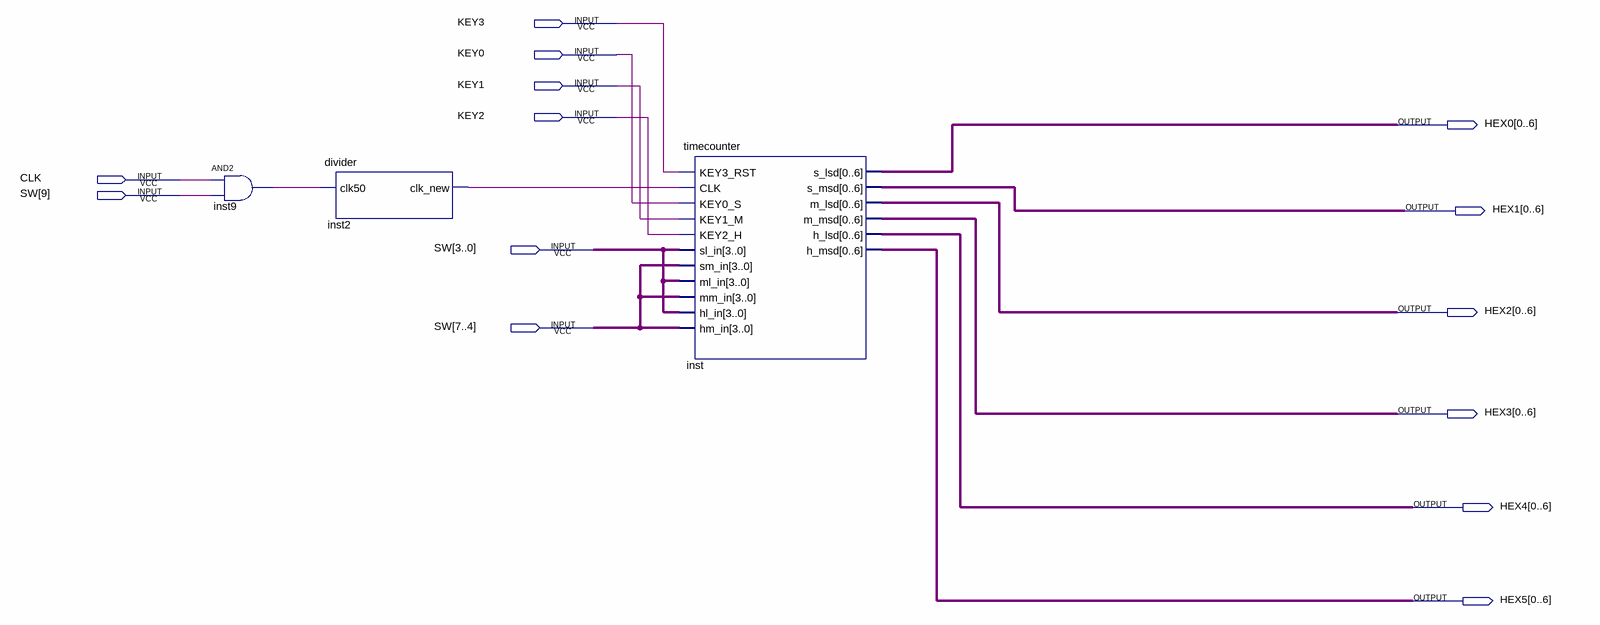
[diagram p0: schematic sheet]
// Quartus schematic TImingLab.bdf as structural Verilog: 3 symbols, 14 pins
module TImingLab (
  input  KEY3,
  input  KEY0,
  input  KEY1,
  input  KEY2,
  input  CLK,
  input  [9:0] SW,
  output [0:6] HEX0,
  output [0:6] HEX1,
  output [0:6] HEX2,
  output [0:6] HEX3,
  output [0:6] HEX4,
  output [0:6] HEX5
);

  wire inst2_clk_new, inst9_out;

  and inst9 (inst9_out, CLK, SW[9]);
  divider inst2 (.clk50(inst9_out), .clk_new(inst2_clk_new));
  timecounter inst (
    .KEY3_RST(KEY3), .CLK(inst2_clk_new), .KEY0_S(KEY0), .KEY1_M(KEY1), .KEY2_H(KEY2), .sl_in(SW[3:0]),
    .sm_in(SW[7:4]), .ml_in(SW[3:0]), .mm_in(SW[7:4]), .hl_in(SW[3:0]), .hm_in(SW[7:4]), .s_lsd(HEX0),
    .s_msd(HEX1), .m_lsd(HEX2), .m_msd(HEX3), .h_lsd(HEX4), .h_msd(HEX5));
endmodule
